# Altium schematic sheet rffrontend.SchDoc
size 297 x 209 mm
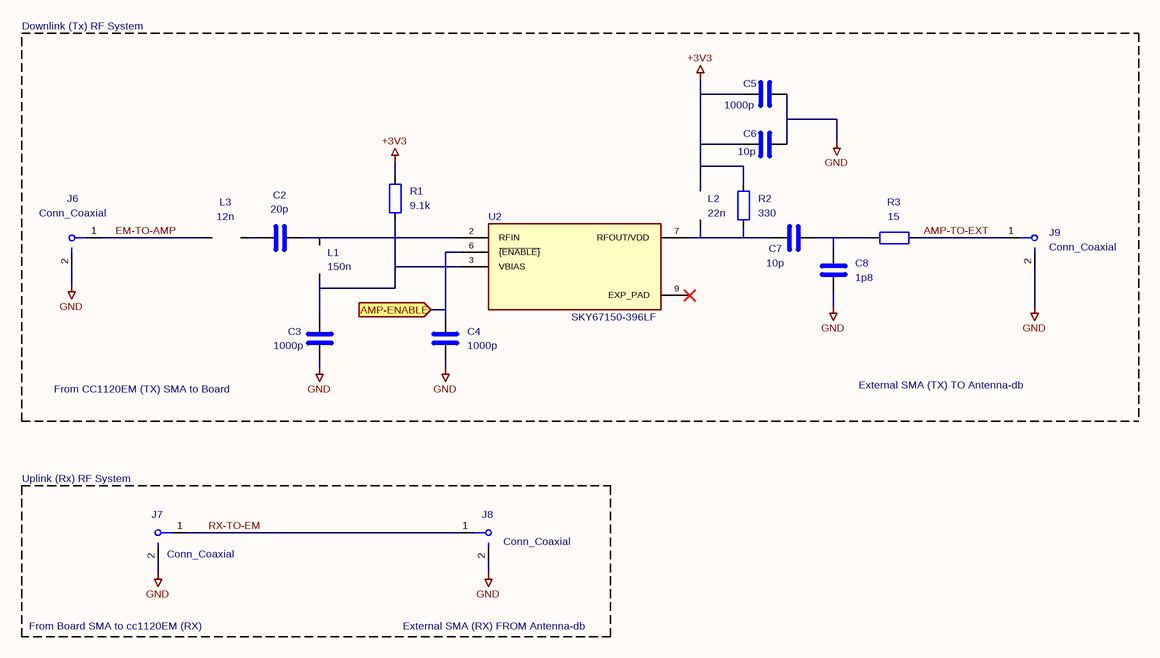
[diagram p0: rffrontend.SchDoc]

## Parts
C2  20p  [C_0402_1005Metric]
C3  1000p  [C_0402_1005Metric]
C4  1000p  [C_0402_1005Metric]
C5  1000p  [C_0402_1005Metric]
C6  10p  [C_0402_1005Metric]
C7  10p  [C_0402_1005Metric]
C8  1p8  [C_0402_1005Metric]
J6  Conn_Coaxial  [U.FL_Hirose_U.FL-R-SMT-1_Vertical]
J7  Conn_Coaxial  [U.FL_Hirose_U.FL-R-SMT-1_Vertical]
J8  Conn_Coaxial  [SMA_Amphenol_132134-11_Vertical]
J9  Conn_Coaxial  [SMA_Amphenol_132134-11_Vertical]
L1  150n  [L_0402_1005Metric]
L2  22n  [L_0402_1005Metric]
L3  12n  [L_0402_1005Metric]
R1  9.1k  [R_0603_1608Metric]
R2  330  [R_0402_1005Metric]
R3  15  [R_0402_1005Metric]
U2  SKY67150-396LF  [SON50P200X200X80-9N]

## Ports
AMP-ENABLE (in)

## Nets
+3V3: C5.1 C6.1 L2.1 R1.1 R2.1
GND: C3.2 C4.2 C5.2 C6.2 C8.2 J6.2(Ext) J7.2(Ext) J8.2(Ext) J9.2(Ext)
AMP-ENABLE: C4.1 U2.6(~{{ENABLE}}) ; port AMP-ENABLE
AMP-TO-EXT: J9.1(In) R3.2
EM-TO-AMP: J6.1(In) L3.1
RX-TO-EM: J7.1(In) J8.1(In)
NetC2_1: C2.1 L3.2
NetC2_2: C2.2 L1.1 U2.2(RFIN)
NetC3_1: C3.1 L1.2 R1.2 U2.3(VBIAS)
NetC7_1: C7.1 L2.2 R2.2 U2.7(RFOUT/VDD)
NetC7_2: C7.2 C8.1 R3.1

Not connected (* = marked no-connect by the designer): U2 9(EXP_PAD)*

## Notes on the sheet
- Downlink (Tx) RF System
- From CC1120EM (TX) SMA to Board
- External SMA (TX) TO Antenna-db
- (near J7) Uplink (Rx) RF System
- From Board SMA to cc1120EM (RX)
- External SMA (RX) FROM Antenna-db
- 1
- 2
- 3
- 4
- 5
- 6
- A
- B
- C
- D
- Title:
- File: rffrontend.kicad_sch
- Sheet: /
- KiCad E.D.A.  kicad (5.1.4)-1
- Size: A4
- Date:
- Rev:
- Id: 1/1

## Library data of the parts
C2-C8 = C: Footprint: Capacitor_SMD:C_0402_1005Metric
  C2: Value: 20p
  C3-C5: Value: 1000p
  C6 C7: Value: 10p
  C8: Value: 1p8
L1-L3 = L: Footprint: Inductor_SMD:L_0402_1005Metric
  L1: Value: 150n
  L2: Value: 22n
  L3: Value: 12n
R1-R3 = R
  R1: Value: 9.1k; Footprint: Resistor_SMD:R_0603_1608Metric
  R2: Value: 330; Footprint: Resistor_SMD:R_0402_1005Metric
  R3: Value: 15; Footprint: Resistor_SMD:R_0402_1005Metric
U2 = SKY67150-396LF: MANUFACTURER: Skyworks; SNAPEDA_PACKAE_ID: 8744; STANDARD: IPC-7351B; PARTREV: May 3,2017; Value: SKY67150-396LF
J6-J9 = Conn_Coaxial: Value: Conn_Coaxial
  J6 J7: Footprint: Connector_Coaxial:U.FL_Hirose_U.FL-R-SMT-1_Vertical
  J8 J9: Footprint: Connector_Coaxial:SMA_Amphenol_132134-11_Vertical